# Altium schematic sheet 原理图.SchDoc
size A3
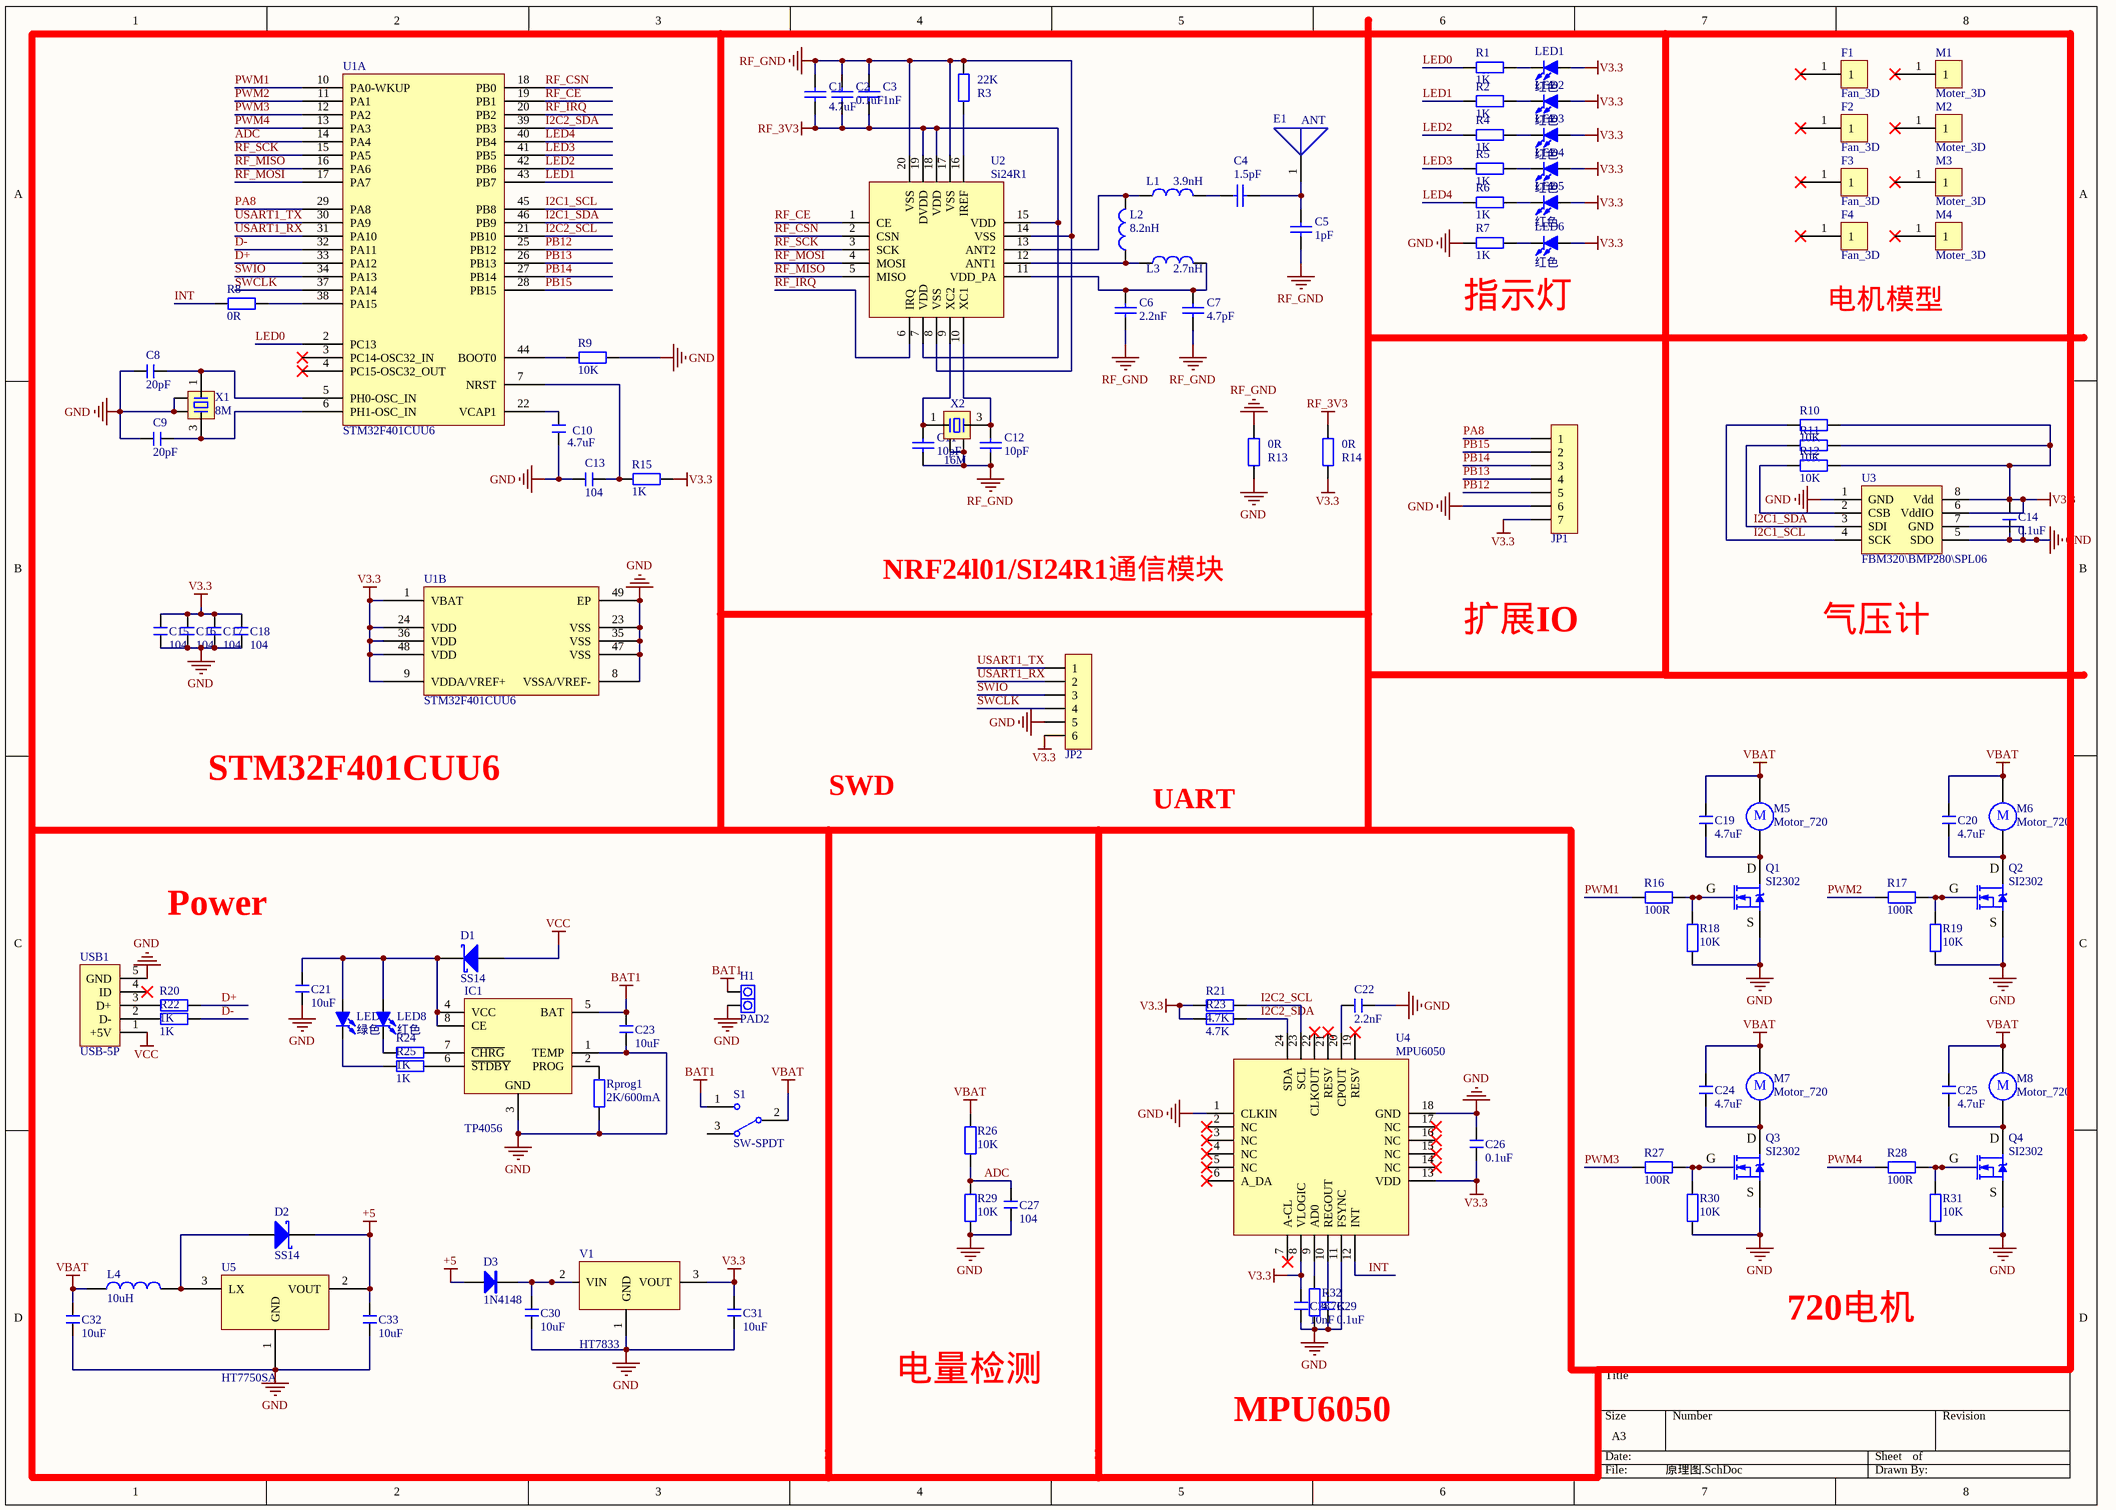
[diagram p0: 原理图.SchDoc]

## Parts
C1  value 4.7uF  [C 0603_L]  (hidden comment: C_0603)
C2  value 0.1uF  [C 0603_L]  (hidden comment: C_0603)
C3  value 1nF  [C 0603_L]  (hidden comment: C_0603)
C4  value 1.5pF  [C 0603_L]  (hidden comment: C_0603)
C5  value 1pF  [C 0603_L]  (hidden comment: C_0603)
C6  value 2.2nF  [C 0603_L]  (hidden comment: C_0603)
C7  value 4.7pF  [C 0603_L]  (hidden comment: C_0603)
C8  20pF  [R 0603_M]
C9  20pF  [R 0603_M]
C10  4.7uF  [C 0603_L]
C11  value 10pF  [C 0603_L]  (hidden comment: C_0603)
C12  value 10pF  [C 0603_L]  (hidden comment: C_0603)
C13  104  [C 0603_L]
C14  0.1uF  [C 0603_L]
C15  104  [C 0603_L]
C16  104  [C 0603_L]
C17  104  [C 0603_L]
C18  104  [C 0603_L]
C19  4.7uF  [C 0603_L]
C20  4.7uF  [C 0603_L]
C21  10uF  [C 0603_L]
C22  2.2nF  [C 0603_L]
C23  10uF  [C 0603_L]
C24  4.7uF  [C 0603_L]
C25  4.7uF  [C 0603_L]
C26  0.1uF  [C 0603_L]
C27  104  [C 0603_L]
C28  10nF  [C 0603_L]
C29  0.1uF  [C 0603_L]
C30  10uF  [C 0603_L]
C31  10uF  [C 0603_L]
C32  10uF  [C 0603_L]
C33  10uF  [C 0603_L]
D1  SS14  [SMA]
D2  SS14  [SMA]
D3  1N4148  [MINI_MELF (LL34)]
E1  ANT  [ANT - duplicate]
F1  Fan_3D  [BLADEB]
F2  Fan_3D  [BLADEB]
F3  Fan_3D  [BLADEB]
F4  Fan_3D  [BLADEB]
H1  PAD2  [PAD2-2.54]
IC1  TP4056  [SOP8_N]
JP1  HDR-1X7  [HDR2.54-LI-7P]  (value not drawn)
JP2  HDR-1X6  [SH1.0-6P]  (value not drawn)
L1  value 3.9nH  [L 0603]  (hidden comment: Inductor)
L2  value 8.2nH  [L 0603]  (hidden comment: Inductor)
L3  value 2.7nH  [L 0603]  (hidden comment: Inductor)
L4  10uH  [L 0805]
LED1  红色  [LED 0603R]
LED2  红色  [LED 0603R]
LED3  红色  [LED 0603R]
LED4  红色  [LED 0603R]
LED5  红色  [LED 0603R]
LED6  红色  [LED 0603R]
LED7  绿色  [LED 0603G]
LED8  红色  [LED 0603R]
M1  Moter_3D  [720Motor]
M2  Moter_3D  [720Motor]
M3  Moter_3D  [720Motor]
M4  Moter_3D  [720Motor]
M5  Motor_720  [MOTOR]
M6  Motor_720  [MOTOR]
M7  Motor_720  [MOTOR]
M8  Motor_720  [MOTOR]
Q1  SI2302  [SOT23-3N]
Q2  SI2302  [SOT23-3N]
Q3  SI2302  [SOT23-3N]
Q4  SI2302  [SOT23-3N]
R1  1K  [R 0603_L]
R2  1K  [R 0603_L]
R3  value 22K  [R 0603_L]  (hidden comment: R_0603)
R4  1K  [R 0603_L]
R5  1K  [R 0603_L]
R6  1K  [R 0603_L]
R7  1K  [R 0603_L]
R8  0R  [R 0603_L]
R9  10K  [R 0603_L]
R10  10K  [R 0603_L]
R11  10K  [R 0603_L]
R12  10K  [R 0603_L]
R13  value 0R  [R 0603_L]  (hidden comment: R_0603)
R14  value 0R  [R 0603_L]  (hidden comment: R_0603)
R15  1K  [R 0603_L]
R16  100R  [R 0603_L]
R17  100R  [R 0603_L]
R18  10K  [R 0603_L]
R19  10K  [R 0603_L]
R20  1K  [R 0603_L]
R21  4.7K  [R 0603_L]
R22  1K  [R 0603_L]
R23  4.7K  [R 0603_L]
R24  1K  [R 0603_L]
R25  1K  [R 0603_L]
R26  10K  [R 0603_L]
R27  100R  [R 0603_L]
R28  100R  [R 0603_L]
R29  10K  [R 0603_L]
R30  10K  [R 0603_L]
R31  10K  [R 0603_L]
R32  4.7K  [R 0603_L]
Rprog1  2K/600mA  [R 0603_M]
S1  SW-SPDT  [SWITCH_PWR]
U1  STM32F401CUU6  [QFN48 7X7_M]  (parts A,B of 2)
U2  Si24R1  [QFN20 4x4_M]
U3  FBM320\BMP280\SPL06  [LGA-2_5X2MM]
U4  MPU6050  [QFN24 4x4_M]
U5  HT7750SA  [SOT-89(SOT-89-3)]
USB1  USB-5P  [USB-MICRO_D]
V1  HT7833  [SOT89_M]
X1  8M  [OSC 3225-4P]
X2  16M  [OSC 3225-4P]

## Nets
+5: C33.2 D2.2(K) D3.1(A) U5.2(VOUT)
BAT1: C23.2 H1.1 IC1.5(BAT) S1.1
GND: C8.2 C9.2 C10.2 C13.1 C14.1 C15.1 C16.1 C17.1 C18.1 C21.1 C22.1 C23.1 C26.2 C27.1 C28.1 C29.1 C30.1 C31.1 C32.1 C33.1 H1.2 IC1.1(TEMP) IC1.3(GND) JP1.6 JP2.5 Q1.2(S) Q2.2(S) Q3.2(S) Q4.2(S) R7.2 R9.1 R13.1 R18.2 R19.2 R29.1 R30.2 R31.2 R32.2 Rprog1.1 U1.8(VSSA/VREF-) U1.23(VSS) U1.35(VSS) U1.47(VSS) U1.49(EP) U3.1(GND) U3.5(SDO) U3.7(GND) U4.1(CLKIN) U4.11(FSYNC) U4.18(GND) U5.1(GND) USB1.5(GND) V1.1(GND) X1.2 X1.4
RF_3V3: C1.1 C2.1 C3.1 R14.2 U2.7(VDD) U2.15(VDD) U2.18(VDD) U2.19(DVDD)
RF_GND: C1.2 C2.2 C3.2 C5.1 C6.1 C7.1 C11.1 C12.1 R3.2 R13.2 U2.8(VSS) U2.14(VSS) U2.17(VSS) U2.20(VSS) X2.2 X2.4
V3.3: C14.2 C15.2 C16.2 C17.2 C18.2 C26.1 C28.2 C31.2 JP1.7 JP2.6 LED1.1(A) LED2.1(A) LED3.1(A) LED4.1(A) LED5.1(A) LED6.1(A) R10.2 R11.2 R12.2 R14.1 R15.2 R21.2 R23.2 U1.1(VBAT) U1.9(VDDA/VREF+) U1.24(VDD) U1.36(VDD) U1.48(VDD) U3.6(VddIO) U3.8(Vdd) U4.8(VLOGIC) U4.13(VDD) V1.3(VOUT)
VBAT: C19.2 C20.2 C24.2 C25.2 C32.2 L4.1 M5.1 M6.1 M7.1 M8.1 R26.2 S1.2
VCC: D1.1(A) USB1.1(+5V)
ADC: C27.2 R26.1 R29.2 U1.14(PA4)
D+: R20.2 U1.33(PA12)
D-: R22.2 U1.32(PA11)
I2C1_SCL: R10.1 U1.45(PB8) U3.4(SCK)
I2C1_SDA: R11.1 U1.46(PB9) U3.3(SDI)
I2C2_SCL: R21.1 U1.21(PB10) U4.23(SCL)
I2C2_SDA: R23.1 U1.39(PB3) U4.24(SDA)
INT: R8.1 U4.12(INT)
LED0: R1.2 U1.2(PC13)
LED1: R2.2 U1.43(PB7)
LED2: R4.2 U1.42(PB6)
LED3: R5.2 U1.41(PB5)
LED4: R6.2 U1.40(PB4)
PA8: JP1.1 U1.29(PA8)
PB12: JP1.5 U1.25(PB12)
PB13: JP1.4 U1.26(PB13)
PB14: JP1.3 U1.27(PB14)
PB15: JP1.2 U1.28(PB15)
PWM1: R16.2 U1.10(PA0-WKUP)
PWM2: R17.2 U1.11(PA1)
PWM3: R27.2 U1.12(PA2)
PWM4: R28.2 U1.13(PA3)
RF_CE: U1.19(PB1) U2.1(CE)
RF_CSN: U1.18(PB0) U2.2(CSN)
RF_IRQ: U1.20(PB2) U2.6(IRQ)
RF_MISO: U1.16(PA6) U2.5(MISO)
RF_MOSI: U1.17(PA7) U2.4(MOSI)
RF_SCK: U1.15(PA5) U2.3(SCK)
SWCLK: JP2.4 U1.37(PA14)
SWIO: JP2.3 U1.34(PA13)
USART1_RX: JP2.2 U1.31(PA10)
USART1_TX: JP2.1 U1.30(PA9)
NetC4_1: C4.1 L1.2
NetC4_2: C4.2 C5.2 E1.1
NetC6_2: C6.2 C7.2 L3.2 U2.11(VDD_PA)
NetC8_1: C8.1 U1.5(PH0-OSC_IN) X1.1
NetC9_1: C9.1 U1.6(PH1-OSC_IN) X1.3
NetC10_1: C10.1 U1.22(VCAP1)
NetC11_2: C11.2 U2.9(XC2) X2.1
NetC12_2: C12.2 U2.10(XC1) X2.3
NetC13_2: C13.2 R15.1 U1.7(NRST)
NetC19_1: C19.1 M5.2 Q1.3(D)
NetC20_1: C20.1 M6.2 Q2.3(D)
NetC21_2: C21.2 D1.2(K) IC1.4(VCC) IC1.8(CE) LED7.1(A) LED8.1(A)
NetC22_2: C22.2 U4.20(CPOUT)
NetC24_1: C24.1 M7.2 Q3.3(D)
NetC25_1: C25.1 M8.2 Q4.3(D)
NetC29_2: C29.2 U4.10(REGOUT)
NetC30_2: C30.2 D3.2(K) V1.2(VIN)
NetD2_1: D2.1(A) L4.2 U5.3(LX)
NetIC1_2: IC1.2(PROG) Rprog1.2
NetIC1_6: IC1.6(~{STDBY}) R25.2
NetIC1_7: IC1.7(~{CHRG}) R24.1
NetL1_1: L1.1 L2.2 U2.13(ANT2)
NetL2_1: L2.1 L3.1 U2.12(ANT1)
NetLED1_2: LED1.2(K) R1.1
NetLED2_2: LED2.2(K) R2.1
NetLED3_2: LED3.2(K) R4.1
NetLED4_2: LED4.2(K) R5.1
NetLED5_2: LED5.2(K) R6.1
NetLED6_2: LED6.2(K) R7.1
NetLED7_2: LED7.2(K) R25.1
NetLED8_2: LED8.2(K) R24.2
NetQ1_1: Q1.1(G) R16.1 R18.1
NetQ2_1: Q2.1(G) R17.1 R19.1
NetQ3_1: Q3.1(G) R27.1 R30.1
NetQ4_1: Q4.1(G) R28.1 R31.1
NetR3_1: R3.1 U2.16(IREF)
NetR8_2: R8.2 U1.38(PA15)
NetR9_2: R9.2 U1.44(BOOT0)
NetR12_1: R12.1 U3.2(CSB)
NetR20_1: R20.1 USB1.3(D+)
NetR22_1: R22.1 USB1.2(D-)
NetR32_1: R32.1 U4.9(AD0)

Not connected (* = marked no-connect by the designer): F1 1*; F2 1*; F3 1*; F4 1*; M1 1*; M2 1*; M3 1*; M4 1*; S1 3; U1 3(PC14-OSC32_IN)* 4(PC15-OSC32_OUT)*; U4 2(NC)* 3(NC)* 4(NC)* 5(NC)* 6(A_DA)* 7(A-CL)* 14(NC)* 15(NC)* 16(NC)* 17(NC)* 19(RESV)* 21(RESV)* 22(CLKOUT)*; USB1 4(ID)*

## Notes on the sheet
- 指示灯
- 电机模型
- NRF24l01/SI24R1通信模块
- 扩展IO
- 气压计
- STM32F401CUU6
- SWD
- UART
- Power
- 720电机
- 电量检测
- MPU6050
- (in symbol Motor_720) M

## Library data of the parts
C8-C10 C13-C33 = C: 贴片电容; BOM名称: 无极性贴片电容; 淘宝ID: 封装库来自淘宝 ID：黄晶宝石; 联系售后: https://shop463601444.taobao.com
D1 D2 = SS14: 肖特基二极管; 属性: 40V/1A; BOM名称: 肖特基二极管; 封装库来自淘宝 ID：黄晶宝石: https://shop463601444.taobao.com
D3 = 1N4148: 开关二极管; BOM名称: 高速开关二极管; 淘宝ID: 封装库来自淘宝 ID：黄晶宝石; 欢迎光临: https://shop463601444.taobao.com
H1 = PAD2: 引线焊盘; 版权归属: 封装库来自淘宝 ID：黄晶宝石; BOM名称: 引线焊盘; 学习资源: https://shop463601444.taobao.com
IC1 = TP4056: 锂电池充电管理; 淘宝ID: 封装库来自淘宝 ID：黄晶宝石; BOM名称: 锂电池充电管理; 学习资源: https://shop463601444.taobao.com
JP1 = Header 7: 7P接插件; 版权归属: 封装库来自淘宝 ID：黄晶宝石; BOM名称: 7P接插件; 学习资源: https://shop463601444.taobao.com
JP2 = Header 6: 6P接插件; 版权归属: 封装库来自淘宝 ID：黄晶宝石; BOM名称: 6P接插件; 学习资源: https://shop463601444.taobao.com
L1-L3 = Inductor_1: 电感; Code_IEC: 1005; Published: 8-Jun-2000; LatestRevisionDate: 17-Jul-2002; LatestRevisionNote: Re-released for DXP Platform.; PackageReference: 0402-A; Publisher: Altium Limited; Code_JEITA: 0402
L4 = L: 小功率贴片电感; 淘宝ID: 封装库来自淘宝 ID：黄晶宝石; BOM名称: 小功率贴片电感; 联系售后: https://shop463601444.taobao.com
LED1-LED8 = LED-SMD: 贴片LED; 版权归属: 封装库来自淘宝 ID：黄晶宝石; BOM名称: 贴片LED; 学习资源: https://shop463601444.taobao.com
M5-M8 = Motor_720: Motor, General Kind; Published: 8-August-2017; PackageReference: RB5-10.5; Publisher: mazhongwei
Q1-Q4 = SI2302: N沟道场效应管; BOM名称: N沟道场效应管; 学习资源: https://shop463601444.taobao.com
R1 R2 R4-R12 R15-R32 Rprog1 = R: 贴片电阻; 版权归属: 来自淘宝 ID：黄晶宝石; BOM名称: 贴片电阻; 联系售后: https://shop463601444.taobao.com
S1 = SW-SPDT: SPDT Subminiature Toggle Switch, Right Angle Mounting, Vertical Actuation; Published: 10-August-2017; PackageReference: SWITCH_PWR; Publisher: mazhongwei
U2 = nRF24L01
U3 = FBM320: 气压计; Published: 8-August-2017; Publisher: mazhongwei; PackageReference: LGA-2_5X2MM
USB1 = USB-5P: 微型USB母座; BOM名称: 微型USB母座; 学习资源: https://shop463601444.taobao.com
V1 = HT71xx: LDO线性稳压芯片; 版权归属: 封装库来自淘宝 ID：黄晶宝石; BOM名称: LDO线性稳压芯片; 学习资源: https://shop463601444.taobao.com
X1 X2 = XTAL-4P: 4脚无源晶振; 版权归属: 源创客; BOM名称: 4脚无源晶振; 学习资源: www.ooocke.com
C1-C7 C11 C12 = C_0603: Published: 8-Jun-2000; LatestRevisionDate: 17-Jul-2002; LatestRevisionNote: Re-released for DXP Platform.; PackageReference: RAD-0.3; Publisher: Altium Limited; PackageDescription: Radial Cap, Thru-Hole; 2 Leads; 0.3 in Pin Spacing
E1 = ANT: Published: 12-August-2017; Publisher: mazhongwei; PackageReference: R_1206
R3 R13 R14 = R_0603: Published: 8-Jun-2000; LatestRevisionDate: 17-Jul-2002; LatestRevisionNote: Re-released for DXP Platform.; PackageReference: AXIAL-0.4; Publisher: Altium Limited; PackageDescription: Axial Device, Thru-Hole; 2 Leads; 0.4 in Pin Spacing